# EAGLE design Netzteil_Endstufe (EAGLE 6.5.0)
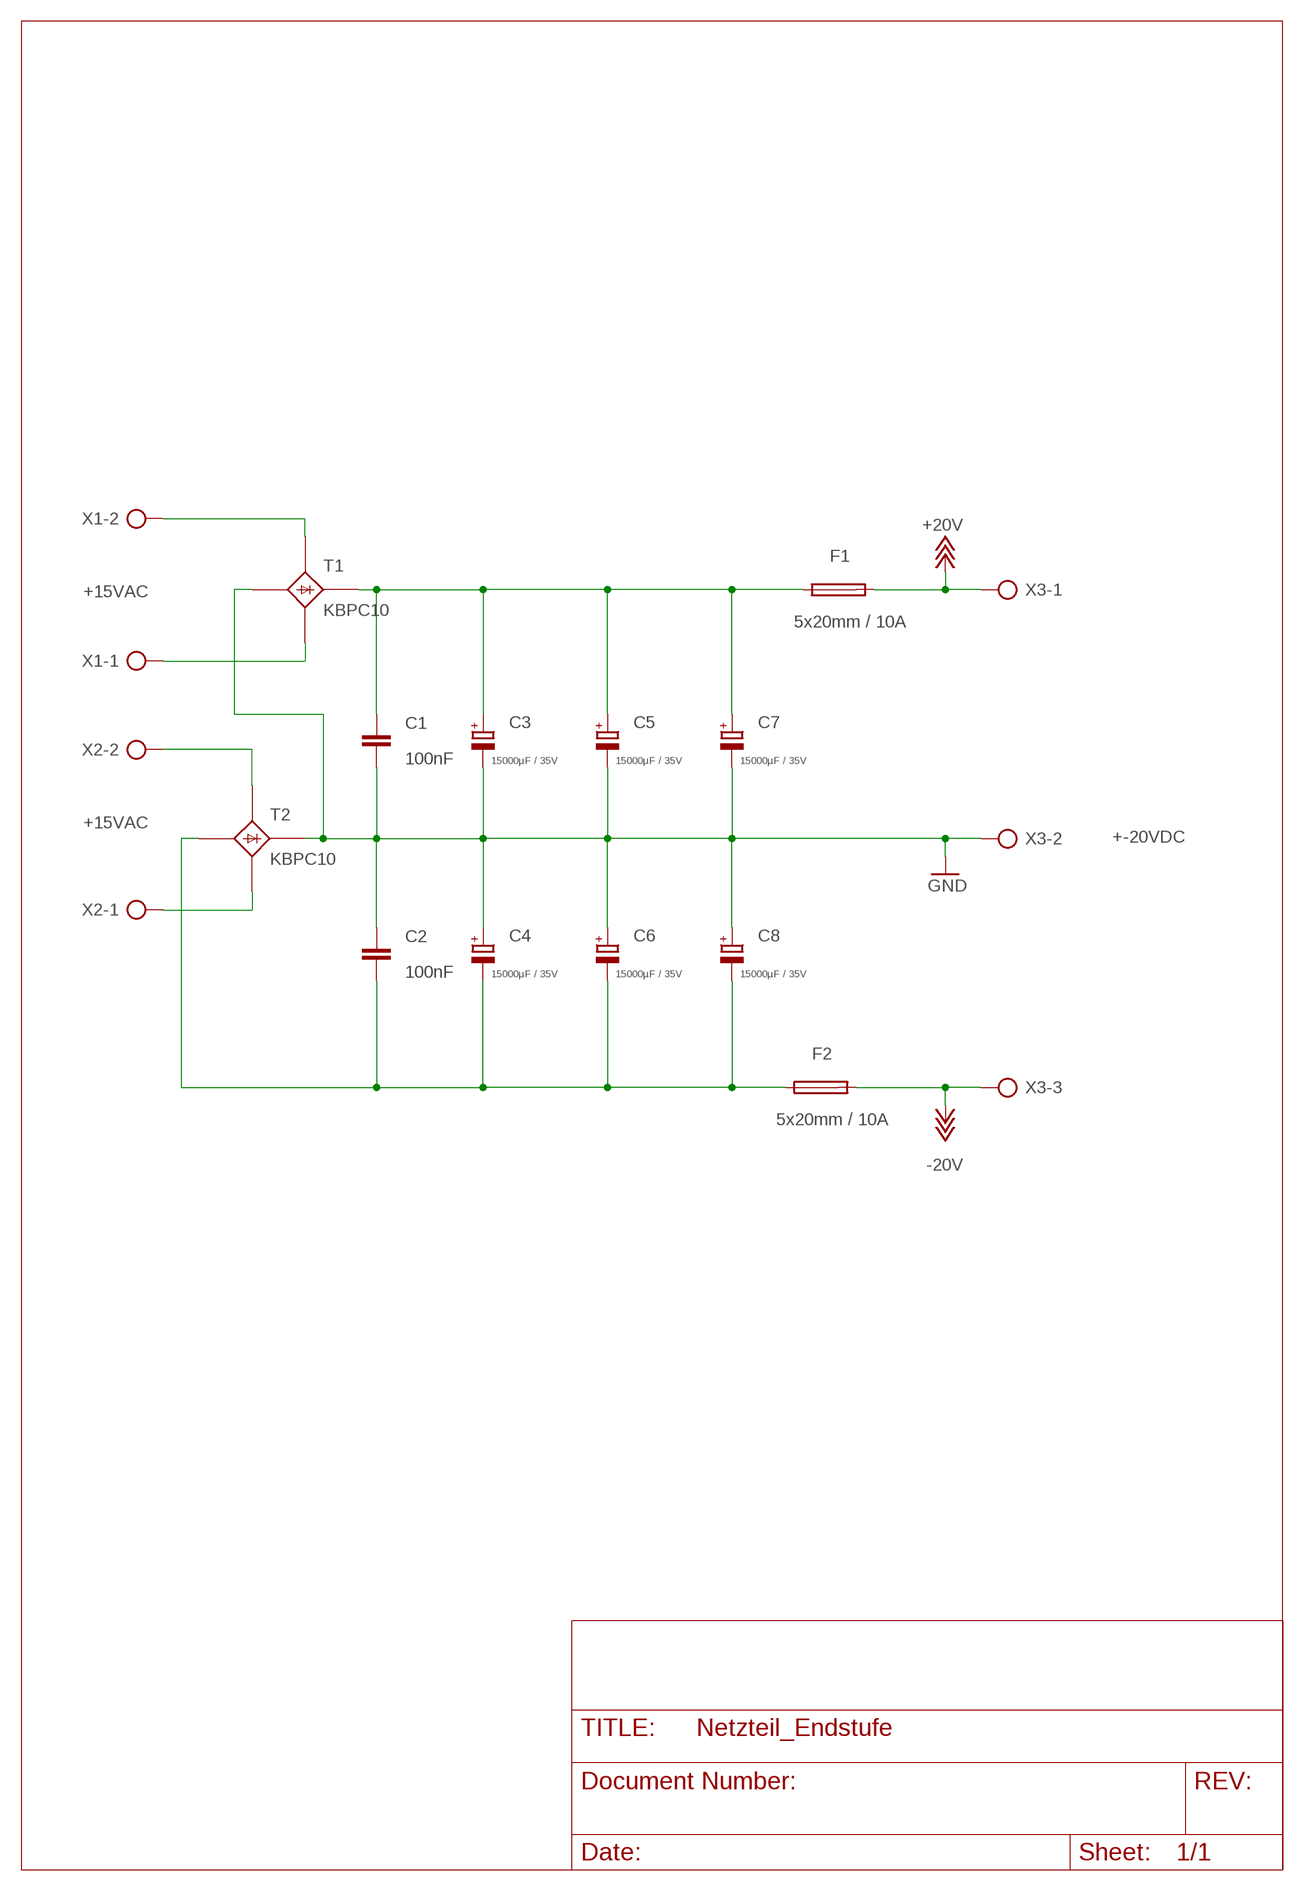
[diagram p0: schematic, sheet 1]

## Parts
C1  100nF  C-EU025-025X050  [C025-025X050]
C2  100nF  C-EU025-025X050  [C025-025X050]
C3  15000µF / 35V  CPOL-EUE10-22.5  [EB22,5D]
C4  15000µF / 35V  CPOL-EUE10-22.5  [EB22,5D]
C5  15000µF / 35V  CPOL-EUE10-22.5  [EB22,5D]
C6  15000µF / 35V  CPOL-EUE10-22.5  [EB22,5D]
C7  15000µF / 35V  CPOL-EUE10-22.5  [EB22,5D]
C8  15000µF / 35V  CPOL-EUE10-22.5  [EB22,5D]
F1  5x20mm / 10A  FUSESHK20L  [SHK20L]
F2  5x20mm / 10A  FUSESHK20L  [SHK20L]
T1  KBPC10  B25A-  [B25A-]
T2  KBPC10  B25A-  [B25A-]
X1  +15VAC  AK300/2  [AK300/2]
X2  +15VAC  AK300/2  [AK300/2]
X3  +-20VDC  AK300/3  [AK300/3]

## Nets
+18V: F1.2A X3.1 ; supply symbol labelled +20V
-18V: F2.2A X3.3 ; supply symbol labelled -20V
GND: C1.2 C2.1 C3.- C4.+ C5.- C6.+ C7.- C8.+ T1.-1(-) T2.+1(+) X3.2
N$1: T2.AC1-(AC1) X2.2
N$2: C1.1 C3.+ C5.+ C7.+ F1.1A T1.+1(+)
N$3: C2.2 C4.- C6.- C8.- F2.1A T2.-1(-)
N$31: T1.AC1-(AC1) X1.2
N$32: T1.AC2-(AC2) X1.1
N$36: T2.AC2-(AC2) X2.1
Unconnected: T1.+ T1.- T1.AC1 T1.AC2 T2.+ T2.- T2.AC1 T2.AC2

## Library data of the parts
C1 C2 = rcl:C-EU: CAPACITOR, European symbol
C3-C8 = rcl:CPOL-EU: POLARIZED CAPACITOR, European symbol
F1 F2 = fuse:FUSE: Fuse; OC_FARNELL: unknown; OC_NEWARK: unknown
T1 T2 = rectifier:B25A-: RECTIFIER 25-A bridge
X1 X2 = con-ptr500:AK300/2: CONNECTOR; OC_FARNELL: unknown; OC_NEWARK: unknown
X3 = con-ptr500:AK300/3: CONNECTOR; OC_FARNELL: unknown; OC_NEWARK: unknown

## Board
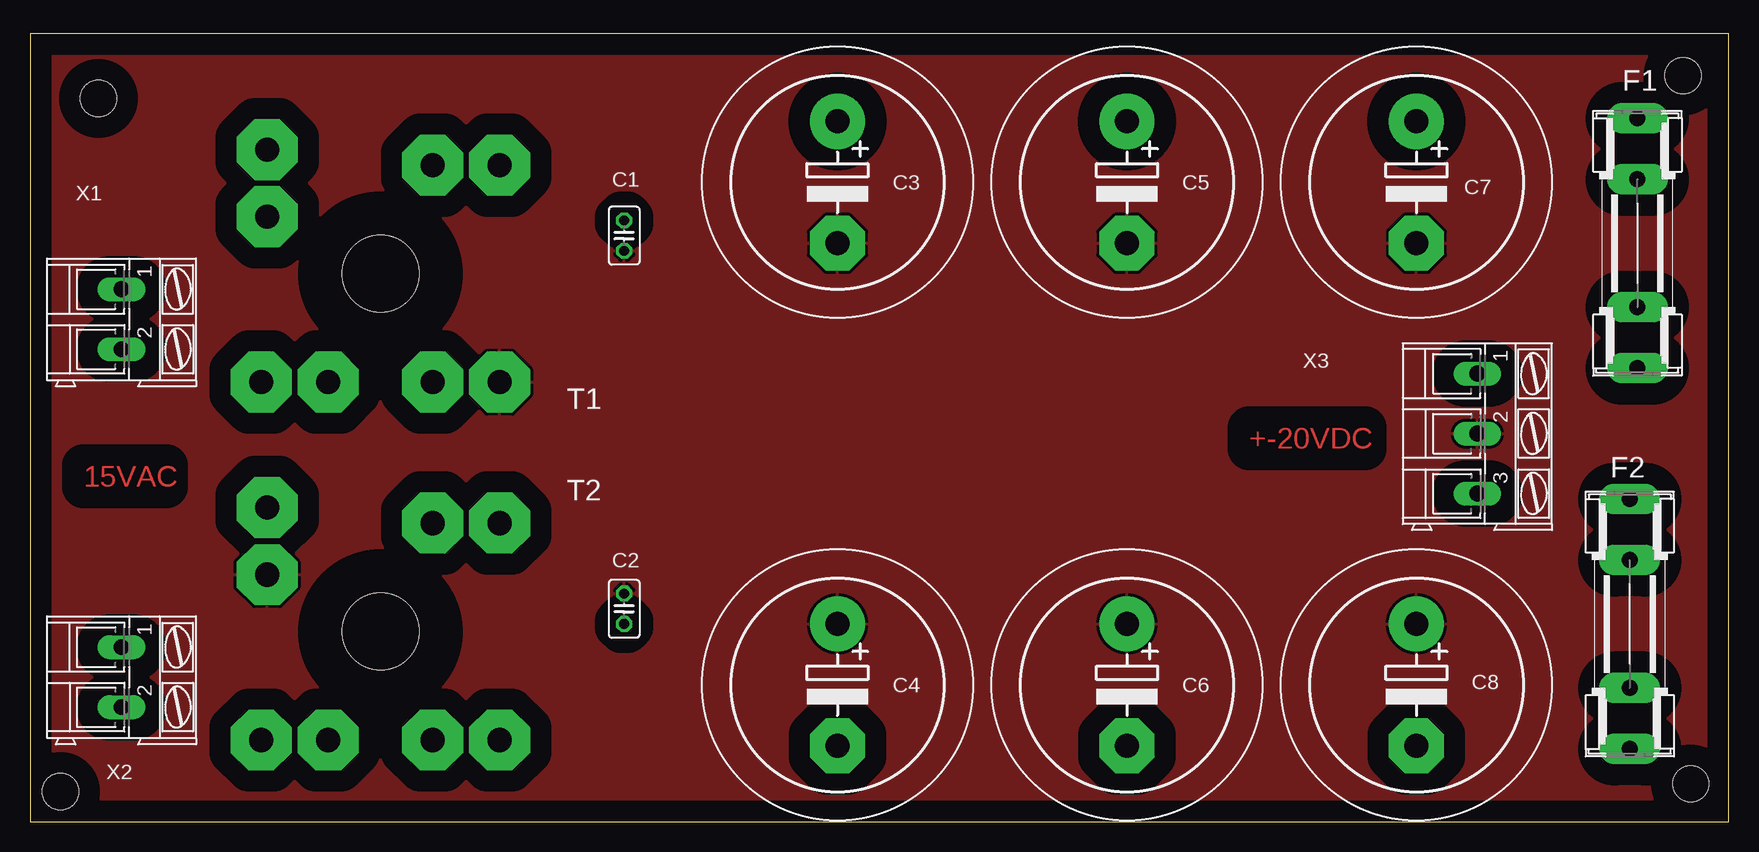
[diagram p1: board, top side]
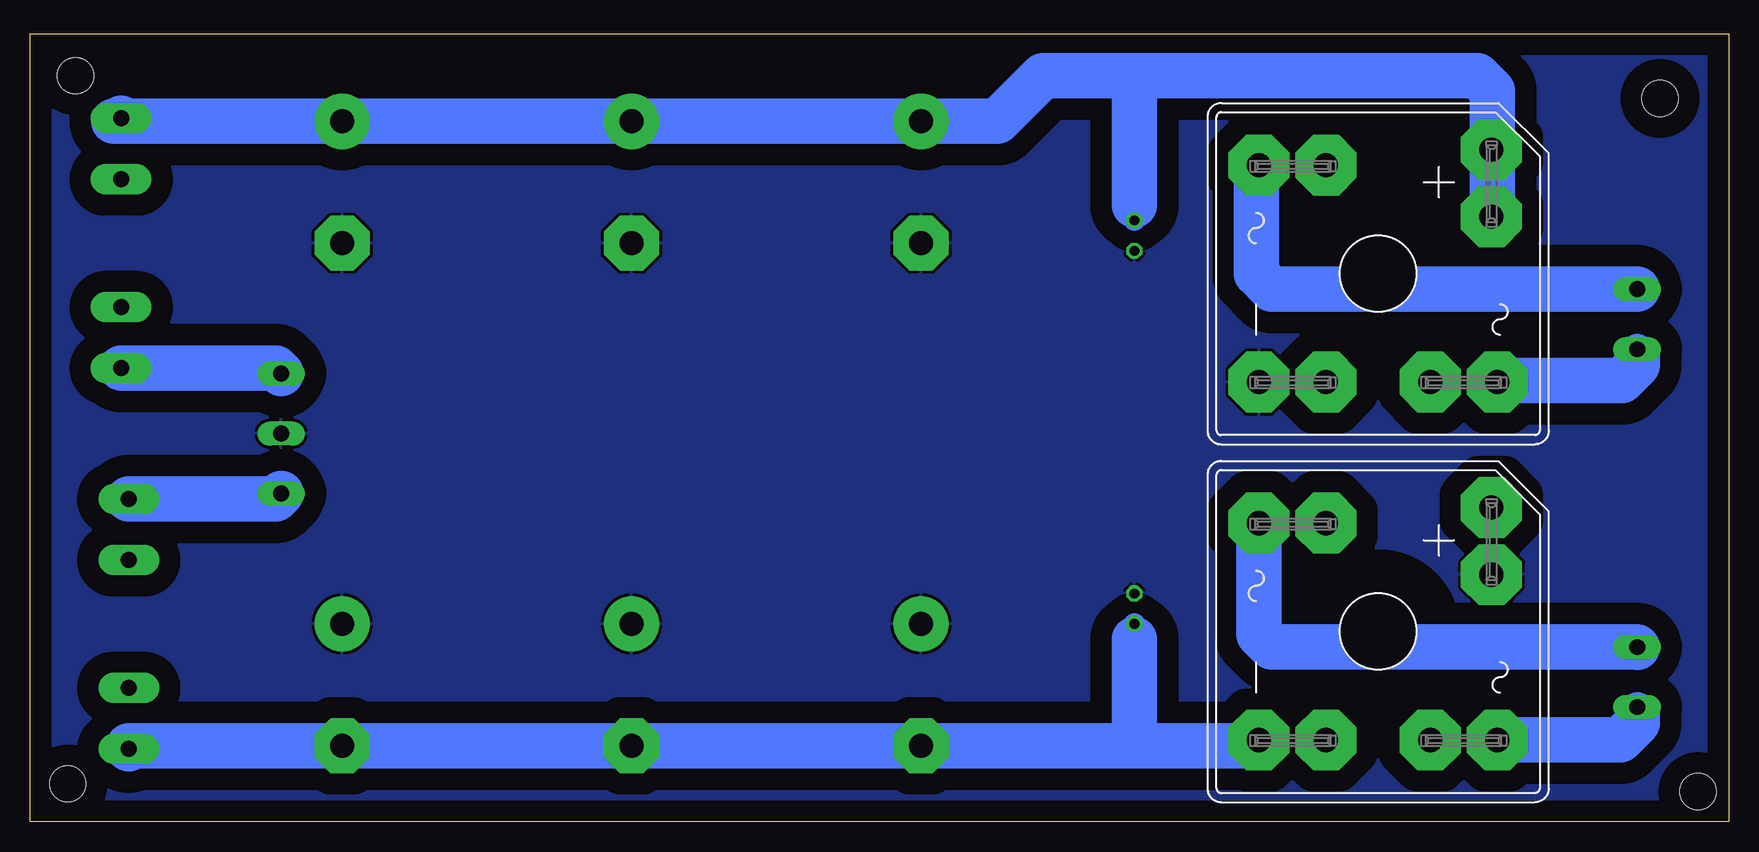
[diagram p2: board, bottom side, seen from below]

Size 141.59 x 65.71 mm. Coordinates in mm from the lower left corner, seen from the top.
Outline: 0,0 141.59,0 141.59,65.71 0,65.71 0,0
Copper layers (1*16): Top 0.035mm / dielectric 1.5mm / Bottom 0.035mm
Design rules "default *": minimum track width 10mil, minimum drill 24mil, track to track 8mil, track to pad 8mil, pad to pad 8mil, via to via 8mil, smd to smd 8mil, copper to edge 20mil, drill to drill 8mil, minimum pad ring 10mil, minimum via ring 8mil, stop-mask expansion 4mil, vias tented up to drill 0mil, thermal gap 10mil
Holes 3 mm at 5.71,60.33 2.54,2.54 137.79,62.23 138.43,3.17

### Footprints (pad centres in the part's own frame; a part is rotated, then mirrored left to right if it is on the bottom)
C025-025X050 = drill 0.813 octagon: 1 -1.27,0; 2 1.27,0
EB22,5D = drill 2.007 pad 4.597: + -5.08,0 | drill 2.007 pad 4.597 octagon: - 5.08,0
SHK20L = drill 1.321 pad 2.54 long: 1A -10.414,0; 1B -5.334,0; 2A 10.414,0; 2B 5.334,0
B25A- = drill 2.007 pad 5.08 octagon: + -10.338,9.449; +1 -4.75,9.449; - 9.042,-4.343; -1 9.042,-9.931; AC1 9.042,4.343; AC1- 9.042,9.931; AC2 -9.042,-4.343; AC2- -9.042,-9.931 | hole 6.401: 0,0
AK300/2 = drill 1.321 long: 1 -2.515,0; 2 2.489,0
AK300/3 = drill 1.321 long: 1 -5.004,0; 2 0,0; 3 5.004,0

### Placement (x,y rotation side)
C1  49.53,48.9 270 top
C2  49.53,17.78 270 top
C3  67.31,53.34 270 top
C4  67.31,11.43 270 top
C5  91.44,53.34 270 top
C6  91.44,11.43 270 top
C7  115.57,53.34 270 top
C8  115.57,11.43 270 top
F1  133.99,48.26 270 top
F2  133.35,16.51 90 top
T1  29.21,45.72 270 bottom
T2  29.21,15.88 270 bottom
X1  7.62,41.91 270 top
X2  7.62,12.06 270 top
X3  120.65,32.38 270 top

### Tracks (layer width: path | path; a pad name or v marks a point on that pad's centre or on a via)
+18V
  Bottom 3.81: X3.1 121.11,37.85 F1.2A
-18V
  Bottom 3.81: X3.3 121.11,26.92 F2.2A
GND
  pour Bottom (isolate 1.778): 0,0 0,66.04 141.6,66.04 141.6,0
  pour Top (isolate 1.778): 0,0 0,66.04 141.6,66.04 141.6,0
N$1
  Bottom 2.54: X2.2 7.62,8.89
  Bottom 3.81: 19.13,6.99 T2.AC1- 9.04,6.83 7.62,8.26 7.62,8.89
N$2
  Bottom 1.778: C1.1 49.53,51.44
  Bottom 3.81: 49.53,62.23 29.84,62.23 27.3,62.23 20.95,62.23 19.68,60.96 19.68,50.55 T1.+1 | 49.53,62.23 57.15,62.23 60.96,58.42 C3.+ C5.+ C7.+ 133.99,58.42 | 49.53,51.44 49.53,62.23 | 134.62,58.42 133.99,58.42 | 133.99,58.42 F1.1A
N$3
  Bottom 1.778: C2.2 49.53,15.24
  Bottom 3.81: 49.53,6.35 C4.- C6.- C8.- 133.35,6.35 F2.1A | 49.53,15.24 49.53,6.35 | 49.53,6.35 38.73,6.35 39.14,6.76 T2.-1
N$31
  Bottom 2.54: X1.2 7.62,38.73
  Bottom 3.81: T1.AC1- 19.13,36.83 14.61,36.83 8.89,36.83 7.62,38.1 7.62,38.73
N$32
  Bottom 3.81: X1.1 7.64,44.45 38.1,44.45 39.37,45.72 39.37,55.24 39.14,55.02 T1.AC2-
N$36
  Bottom 3.81: X2.1 7.64,14.61 38.1,14.61 39.14,15.65 T2.AC2-

### Text on the board
Top: +-20VDC | 15VAC